# Altium schematic sheet usb.SchDoc: LPC1768
size 298 x 212 mm; Date: 31.05.2016 15:06:26; SheetNumber: 3
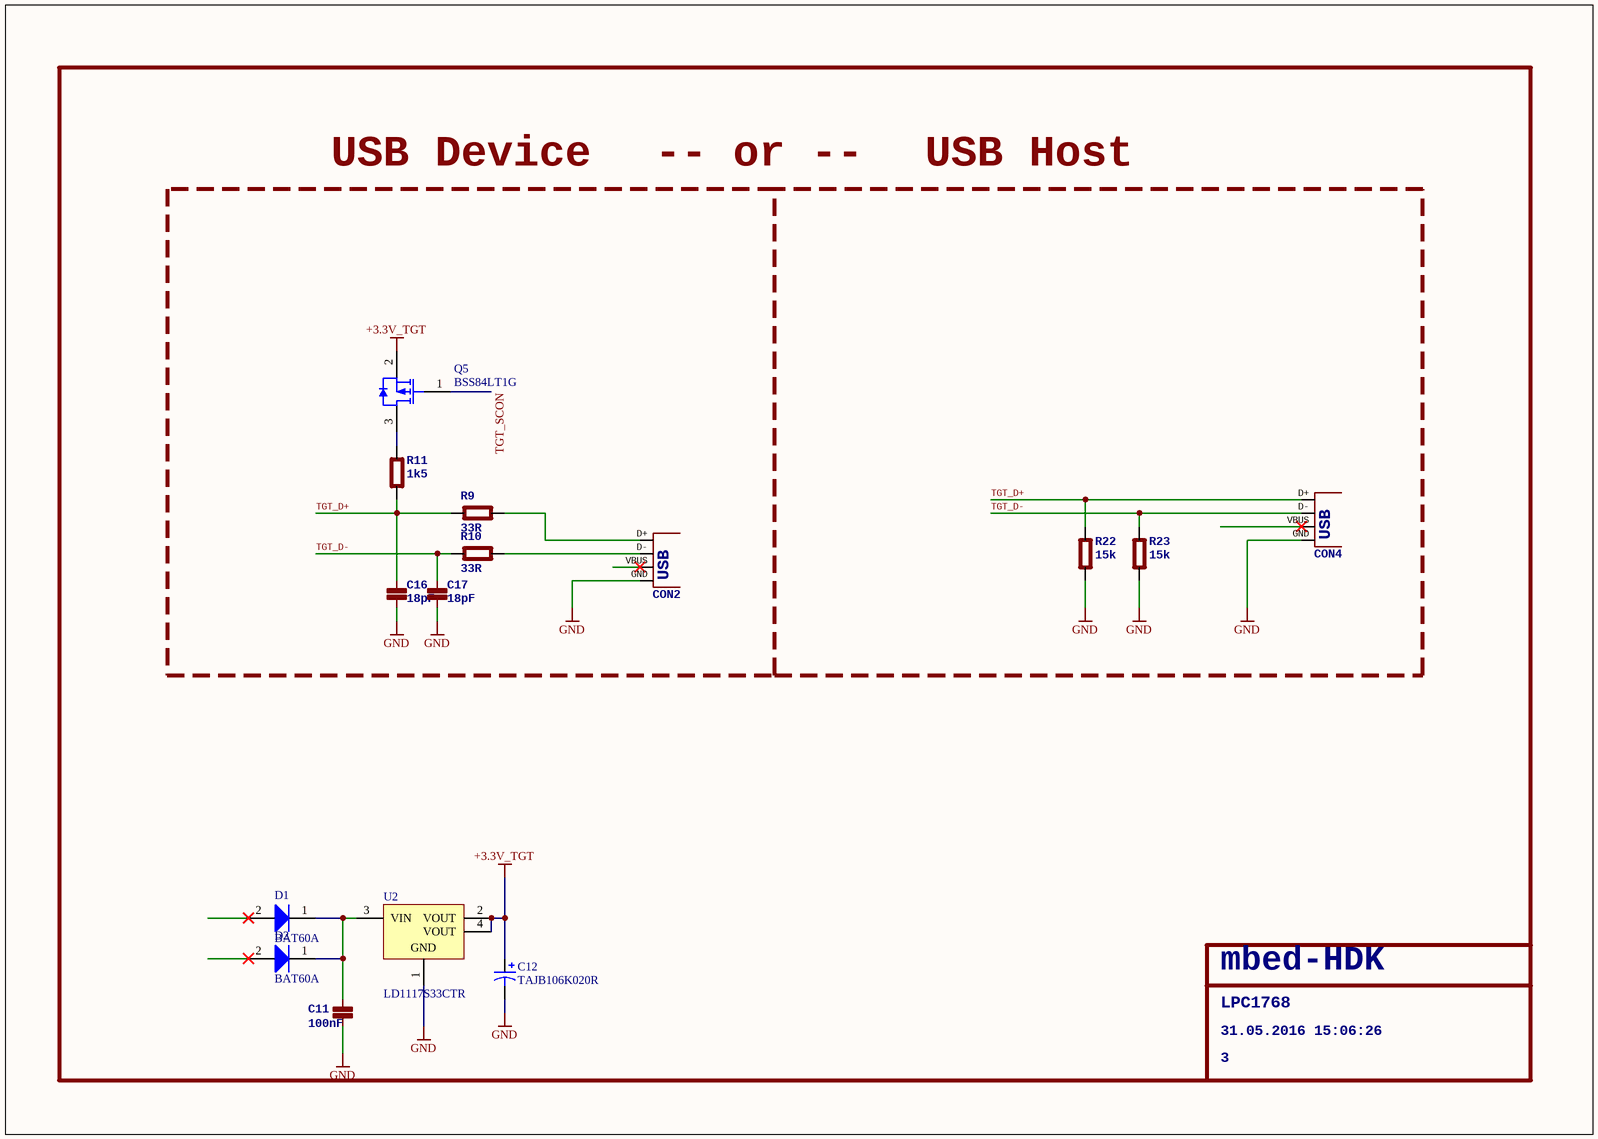
[diagram p0: usb.SchDoc]

## Parts
C11  100nF  [0603]
C12  TAJB106K020R  [AVX-CAPC3528_V]
C16  18pF  [0603]
C17  18pF  [0603]
CON2  USB-MB-S  [USB-MB-S]  (value not drawn)
CON4  USB-A-H  [USB-A-H]  (value not drawn)
D1  BAT60A  [INF-SOD323_V]
D2  BAT60A  [INF-SOD323_V]
Q5  BSS84LT1G  [ONSC-SOT-23-3-318-08_V]
R9  33R  [0603]
R10  33R  [0603]
R11  1k5  [0603]
R22  15k  [0603]
R23  15k  [0603]
U2  LD1117S33CTR  [SOT-223_N]

## Nets
+3.3V_TGT: C12.1 Q5.2(S) U2.2(VOUT) U2.4(VOUT)
GND: C11.2(P$2) C12.2 C16.2(P$2) C17.2(P$2) CON2.GND CON4.GND R22.1(P$1) R23.1(P$1) U2.1(GND)
TGT_D+: C16.1(P$1) CON4.D+ R9.1(P$1) R11.2(P$2) R22.2(P$2)
TGT_D-: C17.1(P$1) CON4.D- R10.1(P$1) R23.2(P$2)
TGT_SCON: Q5.1(G)
NetC11_1: C11.1(P$1) D1.1(K) D2.1(K) U2.3(VIN)
NetCON2_D+: CON2.D+ R9.2(P$2)
NetCON2_D-: CON2.D- R10.2(P$2)
NetQ5_3: Q5.3(D) R11.1(P$1)

Not connected (* = marked no-connect by the designer): CON2 VBUS*; CON4 VBUS*; D1 2(A)*; D2 2(A)*

## Notes on the sheet
- USB Device
- -- or --
- USB Host
- LPC1768
- mbed-HDK
- 31.05.2016 15:06:26
- 3

## Library data of the parts
C11 C16 C17 = C0603
C12 = CMP-0279-00001-1: Capacitor, Tantalum, 10uF 10% 20V MCCT-B (3528); Manufacturer: AVX; Polarity: Polarized; PartNumber: TAJB106K020R; PackageDescription: 2-Pin SMT Capacitor, 3.5 x 2.8 mm Body; ComponentLink1URL: http://www.avx.com/; PackageReference: CAPC3528; ComponentLink2Description: Datasheet; Capacitance: 10uF; Technology: Tantalum; ComponentLink2URL: http://www.avx.com/docs/Catalogs/taj.pdf; Tolerance: 10%; ComponentLink1Description: Manufacturer URL; Rated Voltage: 20V; DatasheetVersion: Jun-13; Mounting Technology: Surface Mount
CON2 = USB-MB-S: USB Connectors; USB: USB
CON4 = USB-A-H: USB Connectors; USB: USB
D1 D2 = CMP-1183-00008-2: Silicon Schottky Diode, -55 to 85 degC, SOD323, Reel, Green; Manufacturer: Infineon; Green: TRUE; VR (max): 10Â V; IF (max): 3,000Â mA; VF (max): 370Â mV; CT (max): 35Â pF; Configuration: Single; PackageDescription: 3-Pin Small Outline Transistor Package, 1.25 x 2 mm Body, 0.65 mm Pitch; PartNumber: BAT60A; Mounting Technology: Surface Mount; PackageReference: SOT323; ComponentLink1Description: Manufacturer URL; Packing: Reel; ComponentLink3URL: http://www.infineon.com/dgdl/SOT323-Package_Overview.pdf?folderId=db3a30431936bc4b0119533e1dcb3c92&fileId=db3a30431936bc4b011953495f283cb1; ComponentLink2URL: http://www.infineon.com/dgdl/bat60aseries.pdf?folderId=db3a304313d846880113def5812204a1&fileId=db3a304313d846880113def70c9304a9; ComponentLink1URL: http://www.infineon.com/; ComponentLink2Description: Datasheet; ComponentLink3Description: Package Specification
Q5 = CMP-1058-00762-1: Power MOSFET Single P-Channel, -50 V, 10 Ohm, 3-Pin SOT-23, Pb-Free, Tape and Reel; Manufacturer: On Semiconductor; Ciss Typ (pF): 36; ID Max (A): 0.13; Channel Polarity: P Channel; VGS(th) Max (V): 2; VGS Max (V): 20; V(BR)DSS Min (V): 50; Crss Typ (pF): 6.5; PD Max (W): 0.225; Coss Typ (pF): 17; Configuration: Single; Mounting Technology: Surface Mount; ComponentLink3URL: http://www.onsemi.cn/pub_link/Collateral/318-08.PDF; ComponentLink1Description: Manufacturer URL; Package Type: SOT-23-3; ComponentLink2URL: http://www.onsemi.com/pub_link/Collateral/BSS84LT1-D.PDF; RoHS: Pb-Free; Packing: Tape and Reel; ComponentLink1URL: http://www.onsemi.com/; PackageVersion: Rev. AP, 11/2009; PackageReference: SOT-23-3-318-08; PackageDescription: 3-Pin Small Outline Transistor, Body 2.92 x 1.3 mm, Pitch 0.95 mm; DatasheetVersion: Rev. 8; ComponentLink3Description: Package Specification; PartNumber: BSS84LT1G; ComponentLink2Description: Datasheet
R9-R11 R22 R23 = R0603
U2 = CMP-0244-00307-1: Fixed Low Drop Positive Voltage Regulator, 3.3V, 4-Pin SOT-223, Tape and Reel; ComponentLink1URL: http://www.st.com; PackageVersion: 2010; ComponentLink1Description: Manufacturer URL; DatasheetVersion: 1/11/2011; ComponentLink2URL: http://www.st.com/internet/com/TECHNICAL_RESOURCES/TECHNICAL_LITERATURE/DATASHEET/CD00000544.pdf; PackageReference: SOT-223; ComponentLink2Description: Datasheet; PackageDescription: 4-Pin SOT-223 Package, 6.5 x 3.5 mm Body, 2.3 mm Pitch, 7 mm Lead Span